# Altium schematic sheet [05]-USB_C_MUX_Interface.SchDoc
size A4
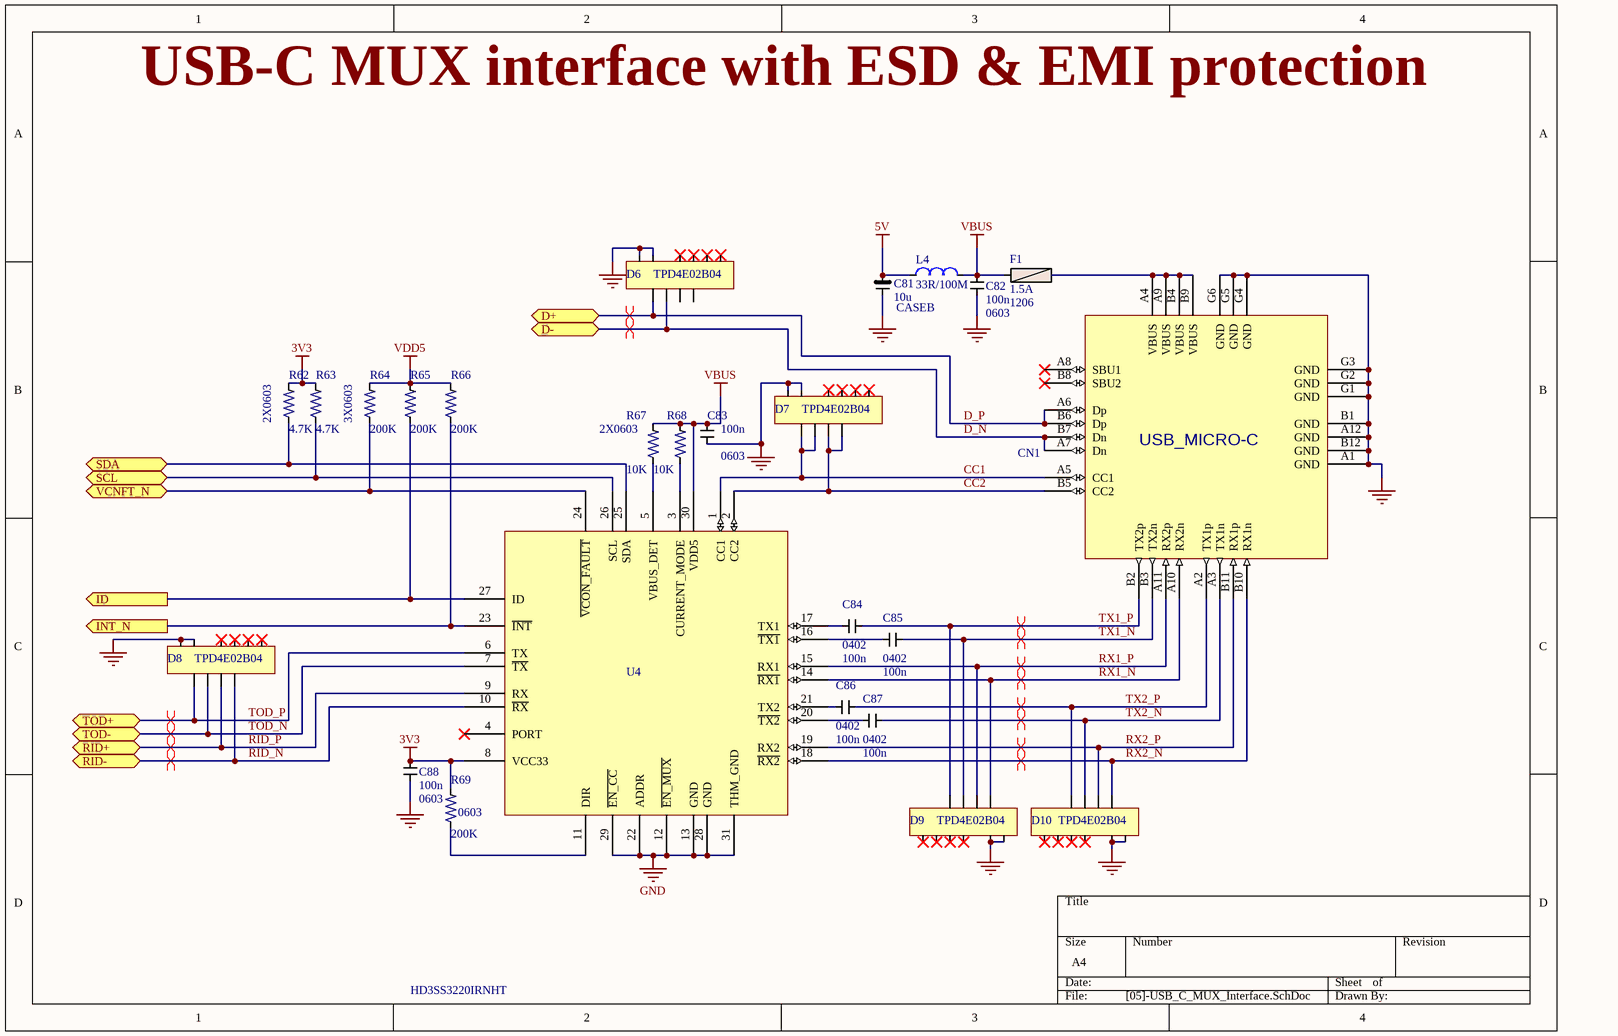
[diagram p0: [05]-USB_C_MUX_Interface.SchDoc]

## Parts
C81  10u  PCB layer: CASEB  [CAPC3528X21N]
C82  100n  PCB footprint: 0603
C83  100n  PCB footprint: 0603
C84  100n  PCB Stake: 0402  [*CAPC1005X60N]
C85  100n  PCB Stake: 0402  [*CAPC1005X60N]
C86  100n  PCB Stake: 0402  [*CAPC1005X60N]
C87  100n  PCB Stake: 0402  [*CAPC1005X60N]
C88  100n  PCB footprint: 0603
CN1  USB_MICRO-C  [PCBComponent_1 - duplicate1]
D6  TPD4E02B04
D7  TPD4E02B04
D8  TPD4E02B04  [TI_TPD4E05U06DQAR]
D9  TPD4E02B04  [TI_TPD4E05U06DQAR]
D10  TPD4E02B04  [TI_TPD4E05U06DQAR]
F1  1.5A  PCB type: 1206  [*CAP3216X125N]
L4  33R/100M  [*FB_BLM18PG121SN1D]
R62  4.7K  foot print: 2X0603  [*RESC1608X50N]
R63  4.7K  [*RESC1608X50N]
R64  200K  foot print: 3X0603  [*RESC1608X60N]
R65  200K  [*RESC1608X60N]
R66  200K  [*RESC1608X60N]
R67  10K  foot print: 2X0603  [*0603]
R68  10K  [*0603]
R69  200K  foot print: 0603  [*RESC1608X60N]
U4  HD3SS3220IRNHT  [QFN40P450X250X80-31N120X320]

## Ports
D+ (bidir), D- (bidir), ID (out), INT_N (out), RID+ (bidir), RID- (bidir), SCL (bidir), SDA (bidir), TOD+ (bidir), TOD- (bidir), VCNFT_N (bidir)

## Nets
3V3: C88.2 R62.2 R63.2 R69.2 U4.8(VCC33)
5V: C81.1 L4.1
GND: C81.2 C82.1 C83.1 C88.1 CN1.A1(GND) CN1.A12(GND) CN1.B1(GND) CN1.B12(GND) CN1.G1(GND) CN1.G2(GND) CN1.G3(GND) CN1.G4(GND) CN1.G5(GND) CN1.G6(GND) D6.3(GND) D6.8(GND) D7.3(GND) D7.8(GND) D8.3(GND) D8.8(GND) D9.3(GND) D9.8(GND) D10.3(GND) D10.8(GND) U4.12(~{EN_MUX}) U4.13(GND) U4.22(ADDR) U4.28(GND) U4.29(~{EN_CC}) U4.31(THM_GND)
VBUS: C82.2 C83.2 F1.1 L4.2 R67.2 R68.2 U4.30(VDD5)
VDD5: R64.2 R65.2 R66.2
CC1: CN1.A5(CC1) D7.1(IO1) D7.2(IO2) U4.1(CC1)
CC2: CN1.B5(CC2) D7.4(IO3) D7.5(IO4) U4.2(CC2)
D_N: CN1.A7(Dn) CN1.B7(Dn) D6.2(IO2) ; port D-
D_P: CN1.A6(Dp) CN1.B6(Dp) D6.1(IO1) ; port D+
ID: R65.1 U4.27(ID) ; port ID
INT_N: R66.1 U4.23(~{INT}) ; port INT_N
RID_N: D8.5(IO4) U4.10(~{RX}) ; port RID-
RID_P: D8.4(IO3) U4.9(RX) ; port RID+
RX1_N: CN1.A10(RX2n) D9.1(IO1) U4.14(~{RX1})
RX1_P: CN1.A11(RX2p) D9.2(IO2) U4.15(RX1)
RX2_N: CN1.B10(RX1n) D10.1(IO1) U4.18(~{RX2})
RX2_P: CN1.B11(RX1p) D10.2(IO2) U4.19(RX2)
SCL: R63.1 U4.26(SCL) ; port SCL
SDA: R62.1 U4.25(SDA) ; port SDA
TOD_N: D8.2(IO2) U4.7(~{TX}) ; port TOD-
TOD_P: D8.1(IO1) U4.6(TX) ; port TOD+
TX1_N: C85.1 CN1.B3(TX2n) D9.4(IO3)
TX1_P: C84.1 CN1.B2(TX2p) D9.5(IO4)
TX2_N: C87.1 CN1.A3(TX1n) D10.4(IO3)
TX2_P: C86.1 CN1.A2(TX1p) D10.5(IO4)
VCNFT_N: R64.1 U4.24(~{VCON_FAULT}) ; port VCNFT_N
NetC84_2: C84.2 U4.17(TX1)
NetC85_2: C85.2 U4.16(~{TX1})
NetC86_2: C86.2 U4.21(TX2)
NetC87_2: C87.2 U4.20(~{TX2})
NetCN1_A4: CN1.A4(VBUS) CN1.A9(VBUS) CN1.B4(VBUS) CN1.B9(VBUS) F1.2
NetR67_1: R67.1 U4.5(VBUS_DET)
NetR68_1: R68.1 U4.3(CURRENT_MODE)
NetR69_1: R69.1 U4.11(DIR)

Not connected (* = marked no-connect by the designer): CN1 A8(SBU1)* B8(SBU2)*; D6 4(IO3) 5(IO4) 6(NC)* 7(NC)* 9(NC)* 10(NC)*; D7 6(NC)* 7(NC)* 9(NC)* 10(NC)*; D8 6(NC)* 7(NC)* 9(NC)* 10(NC)*; D9 6(NC)* 7(NC)* 9(NC)* 10(NC)*; D10 6(NC)* 7(NC)* 9(NC)* 10(NC)*; U4 4(PORT)*

## Layout directives
differential pair: D_N, D_P, RID_N, RID_P, RX1_N, RX1_P, RX2_N, RX2_P, TOD_N, TOD_P, TX1_N, TX1_P, TX2_N, TX2_P

## Notes on the sheet
- USB-C MUX interface with ESD & EMI protection

## Library data of the parts
C81-C88 D6 D7 F1 L4 = Component_1
  C82 C83 C88: Buying URL:: https://uk.farnell.com/avx/06031c104kat2a/cap-0-1-f-100v-10-x7r-0603/dp/2749806?st=100nf
  C84-C87: Buying URL:: https://uk.farnell.com/avx/04023c104kat2a/cap-0-1-f-25v-10-x7r-0402/dp/1867948RL
  F1: Buying URL:: https://uk.farnell.com/murata/blm31pg601sn1l/ferrite-bead-600r-1-5a-1206/dp/2672840
  L4: Buying URL:: https://uk.farnell.com/murata/blm18pg330sn1d/ferrite-bead-0-025ohm-3a-0603/dp/1515742?st=Ferrite%2033R/100MHz,%2025%25,%203A,%2025mR,%200603
CN1 = 1-2295018-2: Connector USB Type C RCP SMD 24 Terminal workable with USB 3.1,3.0 and 2.0 standards.; PCB Package type: smd USB type C connector; MF: TE Connectivity; Designed by: Faheem Minhas; Company: PhasePhotonics; 3D Model: NA; MP: 1-2295018-2; TE_purchase_URL: https://www.te.com/usa-en/product-1-2295018-2.html?te_bu=Cor&te_type=disp&te_campaign=seda_glo_cor-seda-global-disp-prtnr-fy19-seda-model-bom-cta_sma-317_1&elqCampaignId=32493; PCB footprint URL:: https://www.snapeda.com/parts/1-2295018-2/TE%20Connectivity%20AMP%20Connectors/view-part/?ref=snap; Price: 4.29 pound; Buying URL:: https://uk.farnell.com/te-connectivity/1-2295018-2/usb-connector-3-1-type-c-rcpt/dp/2568946?st=USB%20TYPE%20C; Datasheet URL:: http://www.farnell.com/datasheets/2292385.pdf?_ga=2.46605921.752270131.1548443175-886242363.1545409715&_gac=1.159200584.1547824021.Cj0KCQiAj4biBRC-ARIsAA4WaFgEVxY1DDQMjPmwclte-08yP6TbUPRUf-iJ2mTW08_wstvQJToLRRUaArGKEALw_wcB; Date created: 30/01/2019; Last modified: 30/01/2019
D8-D10 = Component_1: mf no.: TPD4E02B04DQAR; Company: TEXES INSTRUMENTS; Package Type: DQAR
R62 R64 R67 R69 = RP73D1J76R8BTDG: Res Thin Film 0603 76.8 Ohm 0.1% 1/10W Â±15ppm/Â°C Molded SMD Paper T/R; MF: TE Connectivity / Holsworthy; Design by: Faheem; Price: None; MP: RP73D1J76R8BTDG; Package: 0603 TE Connectivity / AMP; SnapEDA_Link: https://www.snapeda.com/parts/RP73D1J76R8BTDG/TE%20Connectivity%20/%20Holsworthy/view-part/?ref=snap; Value: *; Availability: Unavailable
  R62: Buying URL:: https://uk.farnell.com/te-connectivity/crgh0603f4k7/res-4k7-1-0-2w-0603-thick-film/dp/2332011?st=4.7K%200603
  R64 R69: Buying URL:: https://uk.farnell.com/vishay/crcw0603200kfkea/res-200k-1-0-1w-0603-thick-film/dp/1469776?st=200k%200603%20resistir
  R67: Buying URL:: https://uk.farnell.com/vishay/crcw060310k0fkea/res-10k-1-0-1w-0603-thick-film/dp/1469748?st=CRCW060310K0FKEA
R63 R65 R66 = RP73D1J76R8BTDG: Res Thin Film 0603 76.8 Ohm 0.1% 1/10W Â±15ppm/Â°C Molded SMD Paper T/R; MF: TE Connectivity / Holsworthy; Design by: Faheem; foot print: 0603; Price: None; MP: RP73D1J76R8BTDG; Package: 0603 TE Connectivity / AMP; SnapEDA_Link: https://www.snapeda.com/parts/RP73D1J76R8BTDG/TE%20Connectivity%20/%20Holsworthy/view-part/?ref=snap; Value: *; Availability: Unavailable
  R63: Buying URL:: https://uk.farnell.com/te-connectivity/crgh0603f4k7/res-4k7-1-0-2w-0603-thick-film/dp/2332011?st=4.7K%200603
  R65 R66: Buying URL:: https://uk.farnell.com/vishay/crcw0603200kfkea/res-200k-1-0-1w-0603-thick-film/dp/1469776?st=200k%200603%20resistir
R68 = RP73D1J76R8BTDG: Res Thin Film 0603 76.8 Ohm 0.1% 1/10W Â±15ppm/Â°C Molded SMD Paper T/R; MF: TE Connectivity / Holsworthy; Design by: Faheem; foot print: 2X0603; Price: None; MP: RP73D1J76R8BTDG; Package: 0603 TE Connectivity / AMP; SnapEDA_Link: https://www.snapeda.com/parts/RP73D1J76R8BTDG/TE%20Connectivity%20/%20Holsworthy/view-part/?ref=snap; Value: *; Buying URL:: https://uk.farnell.com/vishay/crcw060310k0fkea/res-10k-1-0-1w-0603-thick-film/dp/1469748?st=CRCW060310K0FKEA; Availability: Unavailable
U4 = HD3SS3220IRNHT: Super Speed Type-C DRP Port Controller USB 3.1 3.3V/5V T/R 30-Pin WQFN EP; MF: Texas Instruments; Availability: Unavailable; Package: WQFN-30 Texas Instruments; MP: HD3SS3220IRNHT; Price: None; SnapEDA_Link: https://www.snapeda.com/parts/HD3SS3220IRNHT/Texas%20Instruments/view-part/?ref=snap; Value: *